# EAGLE design stspin820 (EAGLE 9.2.2)

## Sheet 1 of 2
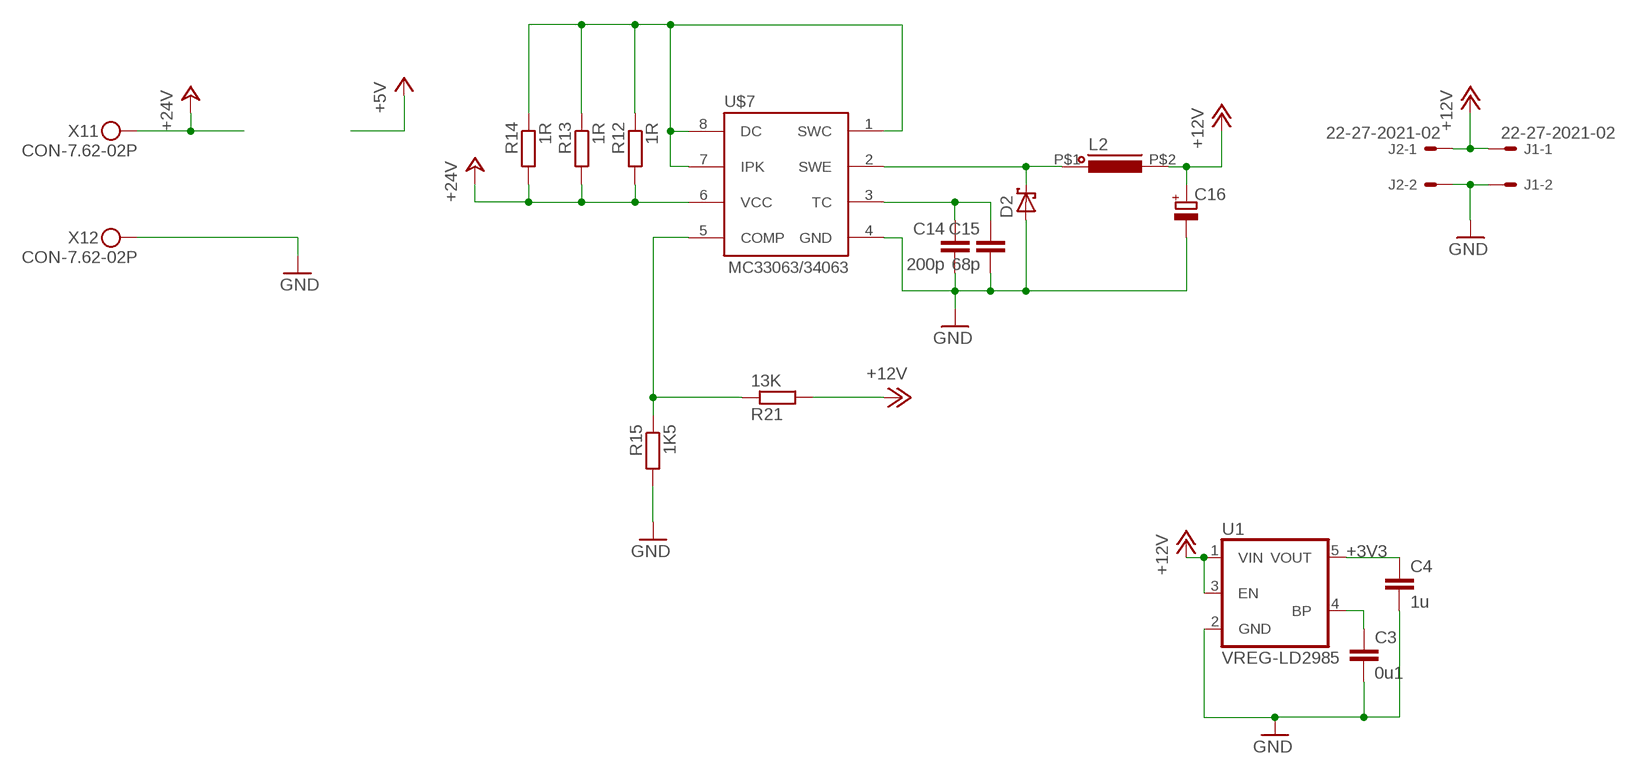
[diagram p0: schematic, sheet 1]

### Parts
C3  0u1  CAP_0805  [CAP0805]
C4  1u  CAP_0805  [CAP0805]
C14  200p  CAP_0805  [CAP0805]
C15  68p  CAP_0805  [CAP0805]
C16  CAP-POL_E3.5-8  [E3,5-8]
D2  DIODE-SH_SMA  [DO214AC]
J1  22-27-2021-02  [6410-02]
J2  22-27-2021-02  [6410-02]
L2  INDUCTORCW68  [CW68]
R12  1R  R_R0805  [RESC2012X50]
R13  1R  R_R0805  [RESC2012X50]
R14  1R  R_R0805  [RESC2012X50]
R15  1K5  R_R0805  [RESC2012X50]
R21  13K  R_R0805  [RESC2012X50]
U1  VREG-LD2985  [SOT95P280X145-5]
U$7  MC33063/MC34063P  [DIL08]
X1  CON-7.62-02P  [KF25C-7.62-02P-13]

### Nets
+3V3: C4.1 U1.5(VOUT) ; supply symbol labelled +5V ; also sheet 2
+12V: C16.+ J1.1 J2.1 L2.P$2 R21.2 U1.1(VIN) U1.3(EN)
+24V: R12.2 R13.2 R14.2 U$7.6(VCC) X1.P$1 ; also sheet 2
GND: C3.2 C4.2 C14.2 C15.2 C16.- D2.A J1.2 J2.2 R15.2 U1.2(GND) U$7.4(GND) X1.P$2 ; also sheet 2
N$22: C14.1 C15.1 U$7.3(TC)
N$23: R12.1 R13.1 R14.1 U$7.1(SWC) U$7.7(IPK) U$7.8(DC)
N$24: D2.C L2.P$1 U$7.2(SWE)
N$25: R15.1 R21.1 U$7.5(COMP)
N$26: C3.1 U1.4(BP)

## Sheet 2 of 2
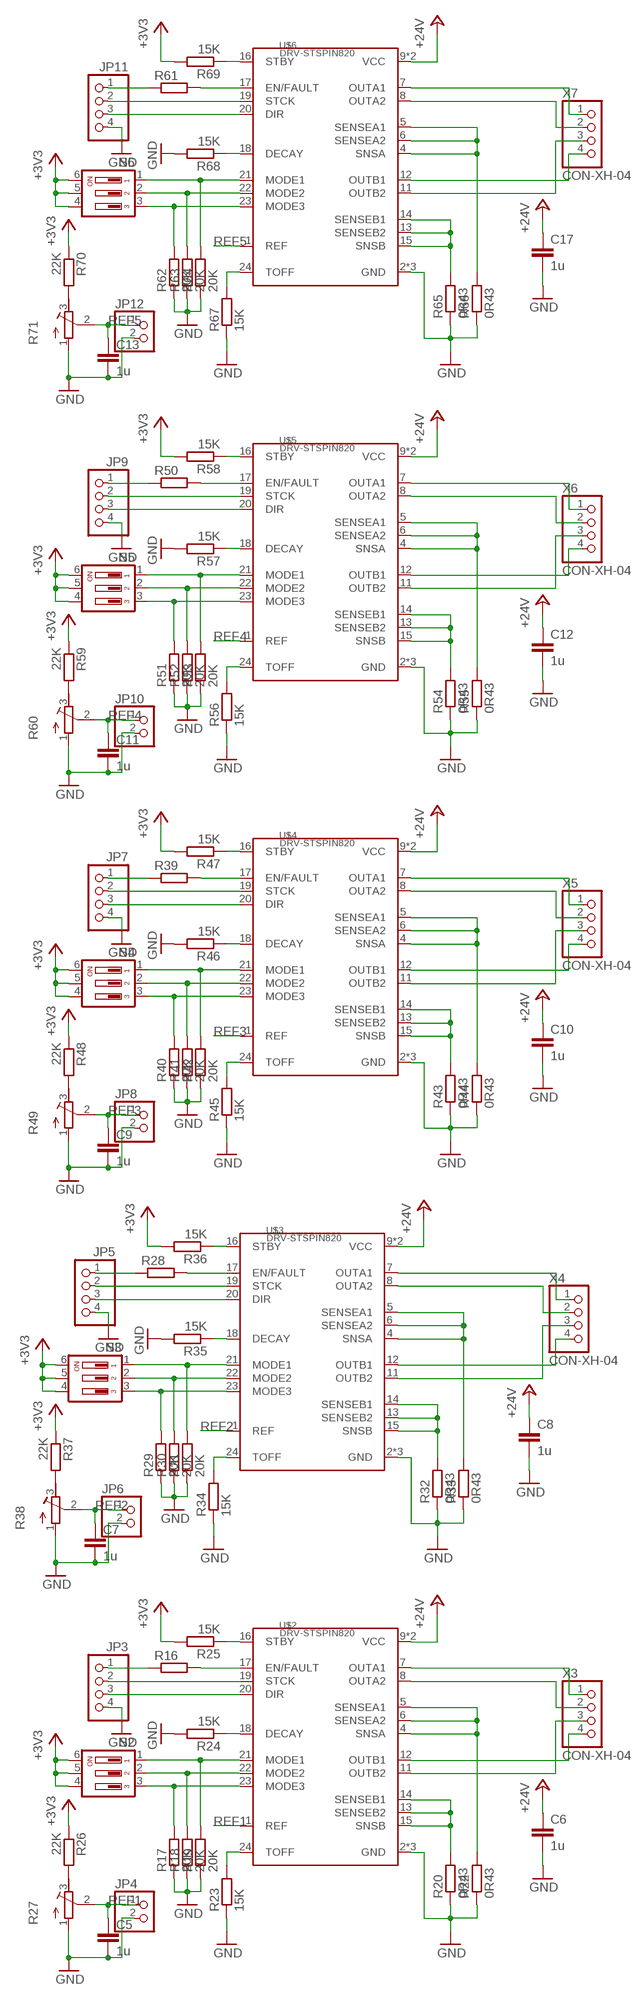
[diagram p1: schematic, sheet 2]

### Parts
C5  1u  CAP_0805  [CAP0805]
C6  1u  CAP_0805  [CAP0805]
C7  1u  CAP_0805  [CAP0805]
C8  1u  CAP_0805  [CAP0805]
C9  1u  CAP_0805  [CAP0805]
C10  1u  CAP_0805  [CAP0805]
C11  1u  CAP_0805  [CAP0805]
C12  1u  CAP_0805  [CAP0805]
C13  1u  CAP_0805  [CAP0805]
C17  1u  CAP_0805  [CAP0805]
JP3  PINHD-1X4  [1X04]
JP4  PINHD-1X2  [1X02]
JP5  PINHD-1X4  [1X04]
JP6  PINHD-1X2  [1X02]
JP7  PINHD-1X4  [1X04]
JP8  PINHD-1X2  [1X02]
JP9  PINHD-1X4  [1X04]
JP10  PINHD-1X2  [1X02]
JP11  PINHD-1X4  [1X04]
JP12  PINHD-1X2  [1X02]
R16  R_R0805  [RESC2012X50]
R17  20K  R_R0805  [RESC2012X50]
R18  20K  R_R0805  [RESC2012X50]
R19  20K  R_R0805  [RESC2012X50]
R20  0R43  R_R1206  [RESC3216X60]
R22  0R43  R_R1206  [RESC3216X60]
R23  15K  R_R0805  [RESC2012X50]
R24  15K  R_R0805  [RESC2012X50]
R25  15K  R_R0805  [RESC2012X50]
R26  22K  R_R0805  [RESC2012X50]
R27  R_POT3296X  [POT-3296X]
R28  R_R0805  [RESC2012X50]
R29  20K  R_R0805  [RESC2012X50]
R30  20K  R_R0805  [RESC2012X50]
R31  20K  R_R0805  [RESC2012X50]
R32  0R43  R_R1206  [RESC3216X60]
R33  0R43  R_R1206  [RESC3216X60]
R34  15K  R_R0805  [RESC2012X50]
R35  15K  R_R0805  [RESC2012X50]
R36  15K  R_R0805  [RESC2012X50]
R37  22K  R_R0805  [RESC2012X50]
R38  R_POT3296X  [POT-3296X]
R39  R_R0805  [RESC2012X50]
R40  20K  R_R0805  [RESC2012X50]
R41  20K  R_R0805  [RESC2012X50]
R42  20K  R_R0805  [RESC2012X50]
R43  0R43  R_R1206  [RESC3216X60]
R44  0R43  R_R1206  [RESC3216X60]
R45  15K  R_R0805  [RESC2012X50]
R46  15K  R_R0805  [RESC2012X50]
R47  15K  R_R0805  [RESC2012X50]
R48  22K  R_R0805  [RESC2012X50]
R49  R_POT3296X  [POT-3296X]
R50  R_R0805  [RESC2012X50]
R51  20K  R_R0805  [RESC2012X50]
R52  20K  R_R0805  [RESC2012X50]
R53  20K  R_R0805  [RESC2012X50]
R54  0R43  R_R1206  [RESC3216X60]
R55  0R43  R_R1206  [RESC3216X60]
R56  15K  R_R0805  [RESC2012X50]
R57  15K  R_R0805  [RESC2012X50]
R58  15K  R_R0805  [RESC2012X50]
R59  22K  R_R0805  [RESC2012X50]
R60  R_POT3296X  [POT-3296X]
R61  R_R0805  [RESC2012X50]
R62  20K  R_R0805  [RESC2012X50]
R63  20K  R_R0805  [RESC2012X50]
R64  20K  R_R0805  [RESC2012X50]
R65  0R43  R_R1206  [RESC3216X60]
R66  0R43  R_R1206  [RESC3216X60]
R67  15K  R_R0805  [RESC2012X50]
R68  15K  R_R0805  [RESC2012X50]
R69  15K  R_R0805  [RESC2012X50]
R70  22K  R_R0805  [RESC2012X50]
R71  R_POT3296X  [POT-3296X]
S2  SW-DIP03S  [DIP03YL]
S3  SW-DIP03S  [DIP03YL]
S4  SW-DIP03S  [DIP03YL]
S5  SW-DIP03S  [DIP03YL]
S6  SW-DIP03S  [DIP03YL]
U$2  DRV-STSPIN820  [QFN24]
U$3  DRV-STSPIN820  [QFN24]
U$4  DRV-STSPIN820  [QFN24]
U$5  DRV-STSPIN820  [QFN24]
U$6  DRV-STSPIN820  [QFN24]
X3  CON-XH-04  [XH-04]
X4  CON-XH-04  [XH-04]
X5  CON-XH-04  [XH-04]
X6  CON-XH-04  [XH-04]
X7  CON-XH-04  [XH-04]

### Nets
+3V3: R25.2 R26.1 R36.2 R37.1 R47.2 R48.1 R58.2 R59.1 R69.2 R70.1 S2.4 S2.5 S2.6 S3.4 S3.5 S3.6 S4.4 S4.5 S4.6 S5.4 S5.5 S5.6 S6.4 S6.5 S6.6 ; also sheet 1
+24V: C6.1 C8.1 C10.1 C12.1 C17.1 U$2.9(VCC) U$2.10(VCC) U$3.9(VCC) U$3.10(VCC) U$4.9(VCC) U$4.10(VCC) U$5.9(VCC) U$5.10(VCC) U$6.9(VCC) U$6.10(VCC) ; also sheet 1
GND: C5.2 C6.2 C7.2 C8.2 C9.2 C10.2 C11.2 C12.2 C13.2 C17.2 JP3.4 JP4.2 JP5.4 JP6.2 JP7.4 JP8.2 JP9.4 JP10.2 JP11.4 JP12.2 R17.1 R18.1 R19.1 R20.1 R22.1 R23.1 R24.2 R27.1(A) R29.1 R30.1 R31.1 R32.1 R33.1 R34.1 R35.2 R38.1(A) R40.1 R41.1 R42.1 R43.1 R44.1 R45.1 R46.2 R49.1(A) R51.1 R52.1 R53.1 R54.1 R55.1 R56.1 R57.2 R60.1(A) R62.1 R63.1 R64.1 R65.1 R66.1 R67.1 R68.2 R71.1(A) U$2.2(GND) U$2.3(GND) U$2.PAD(GND) U$3.2(GND) U$3.3(GND) U$3.PAD(GND) U$4.2(GND) U$4.3(GND) U$4.PAD(GND) U$5.2(GND) U$5.3(GND) U$5.PAD(GND) U$6.2(GND) U$6.3(GND) U$6.PAD(GND) ; also sheet 1
N$19: JP3.2 U$2.19(STCK)
N$20: JP3.3 U$2.20(DIR)
N$21: JP3.1 R16.1
N$27: R16.2 U$2.17(EN/FAULT)
N$28: R19.2 S2.1 U$2.21(MODE1)
N$29: R18.2 S2.2 U$2.22(MODE2)
N$30: R17.2 S2.3 U$2.23(MODE3)
N$31: R20.2 U$2.13(SENSEB2) U$2.14(SENSEB1) U$2.15(SNSB)
N$32: R22.2 U$2.4(SNSA) U$2.5(SENSEA1) U$2.6(SENSEA2)
N$33: U$2.7(OUTA1) X3.1
N$34: U$2.8(OUTA2) X3.2
N$35: R23.2 U$2.24(TOFF)
N$36: R25.1 U$2.16(STBY)
N$37: R24.1 U$2.18(DECAY)
N$39: U$2.11(OUTB2) X3.3
N$40: U$2.12(OUTB1) X3.4
N$41: R26.2 R27.3(E)
N$42: JP5.2 U$3.19(STCK)
N$43: JP5.3 U$3.20(DIR)
N$44: JP5.1 R28.1
N$45: R28.2 U$3.17(EN/FAULT)
N$46: R31.2 S3.1 U$3.21(MODE1)
N$47: R30.2 S3.2 U$3.22(MODE2)
N$48: R29.2 S3.3 U$3.23(MODE3)
N$50: R32.2 U$3.13(SENSEB2) U$3.14(SENSEB1) U$3.15(SNSB)
N$51: R33.2 U$3.4(SNSA) U$3.5(SENSEA1) U$3.6(SENSEA2)
N$52: U$3.7(OUTA1) X4.1
N$53: U$3.8(OUTA2) X4.2
N$54: R34.2 U$3.24(TOFF)
N$55: R36.1 U$3.16(STBY)
N$56: R35.1 U$3.18(DECAY)
N$58: U$3.11(OUTB2) X4.3
N$59: U$3.12(OUTB1) X4.4
N$60: R37.2 R38.3(E)
N$61: JP7.2 U$4.19(STCK)
N$62: JP7.3 U$4.20(DIR)
N$63: JP7.1 R39.1
N$64: R39.2 U$4.17(EN/FAULT)
N$65: R42.2 S4.1 U$4.21(MODE1)
N$67: R41.2 S4.2 U$4.22(MODE2)
N$68: R40.2 S4.3 U$4.23(MODE3)
N$69: R43.2 U$4.13(SENSEB2) U$4.14(SENSEB1) U$4.15(SNSB)
N$70: R44.2 U$4.4(SNSA) U$4.5(SENSEA1) U$4.6(SENSEA2)
N$71: U$4.7(OUTA1) X5.1
N$72: U$4.8(OUTA2) X5.2
N$73: R45.2 U$4.24(TOFF)
N$74: R47.1 U$4.16(STBY)
N$75: R46.1 U$4.18(DECAY)
N$77: U$4.11(OUTB2) X5.3
N$78: U$4.12(OUTB1) X5.4
N$79: R48.2 R49.3(E)
N$80: JP9.2 U$5.19(STCK)
N$81: JP9.3 U$5.20(DIR)
N$82: JP9.1 R50.1
N$84: R50.2 U$5.17(EN/FAULT)
N$85: R53.2 S5.1 U$5.21(MODE1)
N$86: R52.2 S5.2 U$5.22(MODE2)
N$87: R51.2 S5.3 U$5.23(MODE3)
N$88: R54.2 U$5.13(SENSEB2) U$5.14(SENSEB1) U$5.15(SNSB)
N$89: R55.2 U$5.4(SNSA) U$5.5(SENSEA1) U$5.6(SENSEA2)
N$90: U$5.7(OUTA1) X6.1
N$91: U$5.8(OUTA2) X6.2
N$92: R56.2 U$5.24(TOFF)
N$93: R58.1 U$5.16(STBY)
N$94: R57.1 U$5.18(DECAY)
N$96: U$5.11(OUTB2) X6.3
N$97: U$5.12(OUTB1) X6.4
N$98: R59.2 R60.3(E)
N$99: JP11.2 U$6.19(STCK)
N$101: JP11.3 U$6.20(DIR)
N$102: JP11.1 R61.1
N$103: R61.2 U$6.17(EN/FAULT)
N$104: R64.2 S6.1 U$6.21(MODE1)
N$105: R63.2 S6.2 U$6.22(MODE2)
N$106: R62.2 S6.3 U$6.23(MODE3)
N$107: R65.2 U$6.13(SENSEB2) U$6.14(SENSEB1) U$6.15(SNSB)
N$108: R66.2 U$6.4(SNSA) U$6.5(SENSEA1) U$6.6(SENSEA2)
N$109: U$6.7(OUTA1) X7.1
N$110: U$6.8(OUTA2) X7.2
N$111: R67.2 U$6.24(TOFF)
N$112: R69.1 U$6.16(STBY)
N$113: R68.1 U$6.18(DECAY)
N$115: U$6.11(OUTB2) X7.3
N$116: U$6.12(OUTB1) X7.4
N$117: R70.2 R71.3(E)
REF1: C5.1 JP4.1 R27.2(S) U$2.1(REF)
REF2: C7.1 JP6.1 R38.2(S) U$3.1(REF)
REF3: C9.1 JP8.1 R49.2(S) U$4.1(REF)
REF4: C11.1 JP10.1 R60.2(S) U$5.1(REF)
REF5: C13.1 JP12.1 R71.2(S) U$6.1(REF)

## Library data of the parts
C3-C15 C17 = Flamberm:CAP_
C16 = Namenlos:CAP-POL_
D2 = Namenlos:DIODE-SH_
J1 J2 = con-molex:22-?-02: CONNECTOR wire to board 2.54 mm (.1 inch) pitch header; MF: MOLEX; OC_FARNELL: unknown; OC_NEWARK: unknown
JP3 JP5 JP7 JP9 JP11 = pinhead:PINHD-1X4: PIN HEADER
JP4 JP6 JP8 JP10 JP12 = pinhead:PINHD-1X2: PIN HEADER
L2 = Namenlos:INDUCTOR
R12-R26 R28-R37 R39-R48 R50-R59 R61-R70 = Flamberm:R_
R27 R38 R49 R60 R71 = Flamberm:R_POT
S2-S6 = Flamberm:SW-DIP03S: DIL/CODE SWITCH; OC_FARNELL: unknown; OC_NEWARK: unknown
U1 = Flamberm:VREG-LD2985
U$2-U$6 = Flamberm:DRV-STSPIN820
U$7 = adafruit:MC33063/MC34063: MC33063 and MC34063 Basic DC/DC converter with internal power-NPN transistor, 100KHz, 1.5A peak switch current. 3-40 input/output.
X1 = Flamberm:CON-7.62-02P
X3-X7 = Flamberm:CON-XH-04

## Board
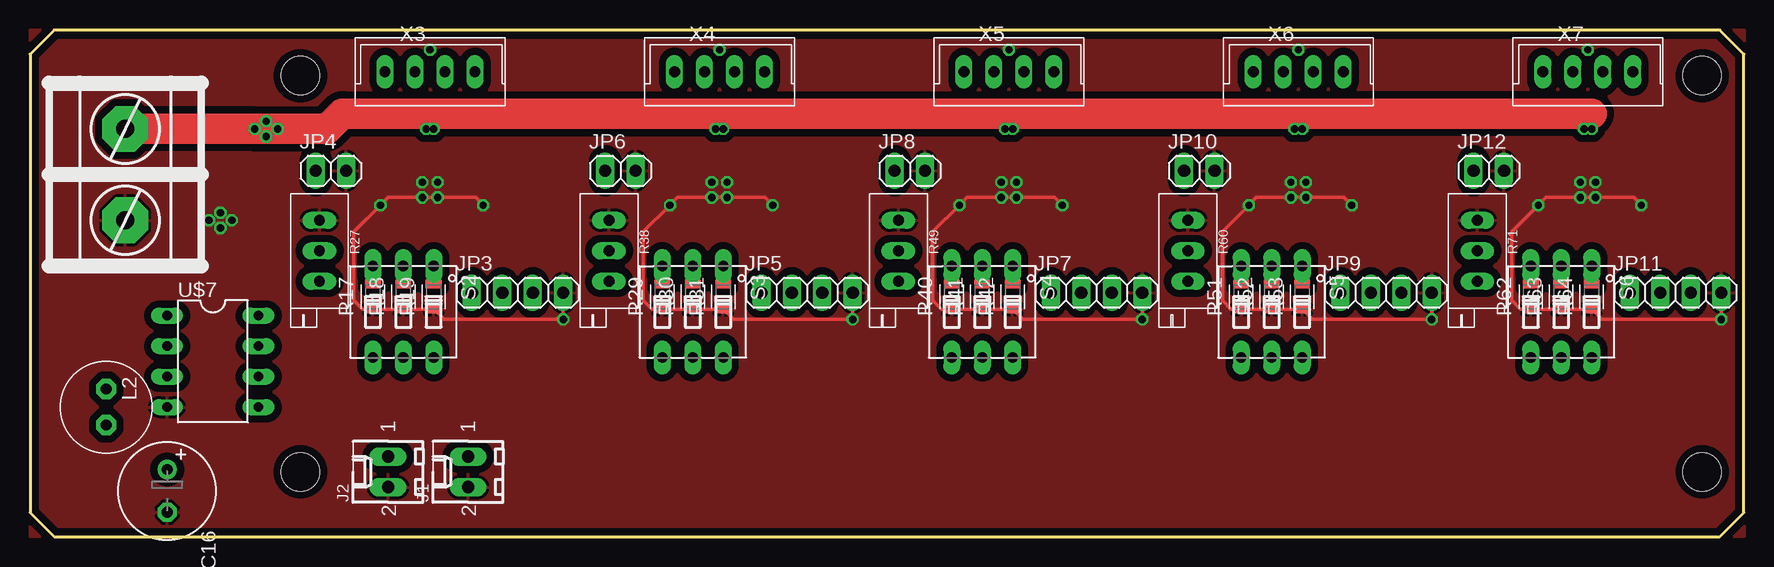
[diagram p2: board, top side]
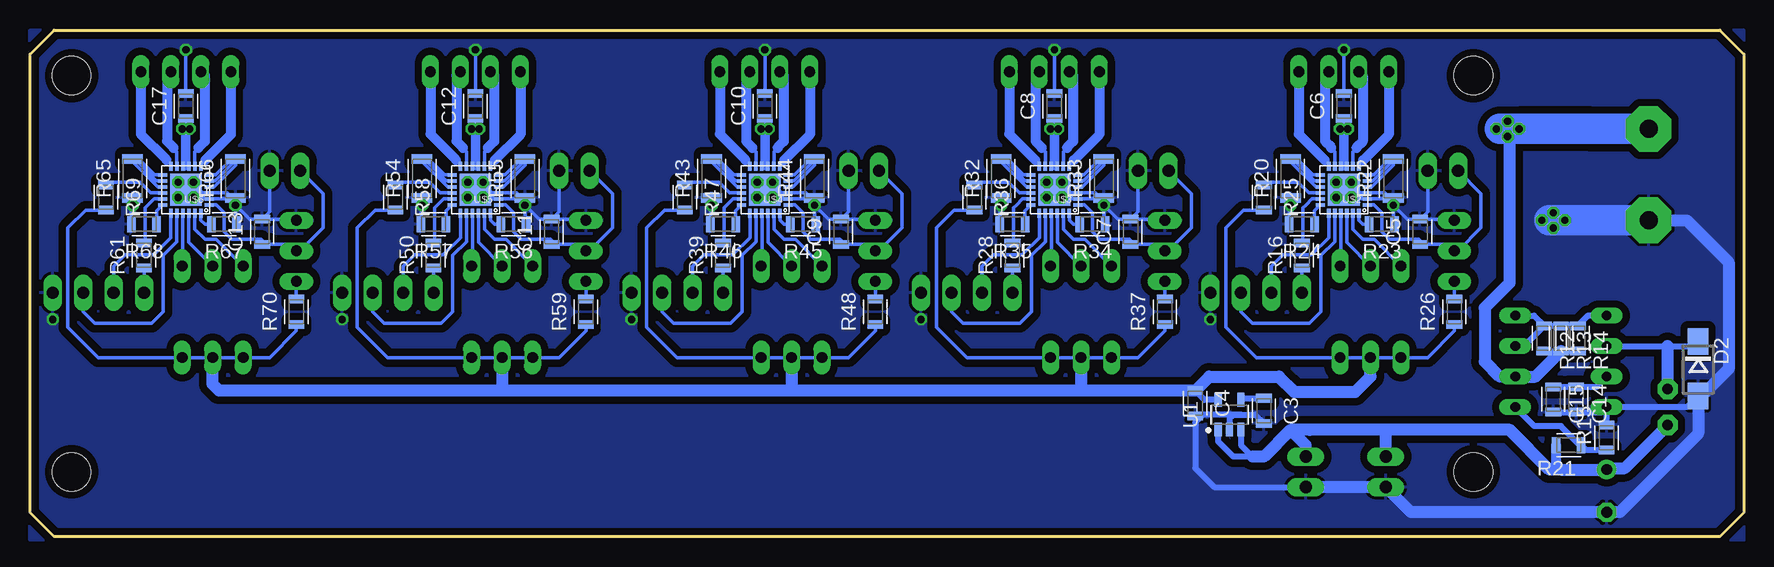
[diagram p3: board, bottom side, seen from below]

Size 142.86 x 42.21 mm. Coordinates in mm from the lower left corner, seen from the top.
Outline: 140.86,42.21 2,42.21 0,40.21 0,2 2,0 140.86,0 142.86,2 142.86,40.21 140.86,42.21
Copper layers (1*16): Top 0.035mm / dielectric 1.5mm / Bottom 0.035mm
Design rules "EagleDesignRules": minimum track width 0.25mm, minimum drill 0.3mm, track to track 0.25mm, track to pad 0.25mm, pad to pad 0.25mm, via to via 0.25mm, smd to smd 0.25mm, copper to edge 0.5mm, drill to drill 0.5mm, minimum pad ring 10mil, minimum via ring 8mil, stop-mask expansion 4mil, vias tented up to drill 0mil, thermal gap 0.25mm
Holes 3.2 mm at 22.54,38.42 22.54,5.4 139.38,5.4 139.38,38.42

### Footprints (pad centres in the part's own frame; a part is rotated, then mirrored left to right if it is on the bottom)
CAP0805 = smd 0.712 x 1.312: 1 -1.05,0; 2 1.05,0
E3,5-8 = drill 0.9 pad 1.6: + -1.778,0 | drill 0.9 pad 1.6 octagon: - 1.778,0
DO214AC = smd 2.2 x 1.7: A 2.25,0; C -2.285,0
6410-02 = drill 1.016 long: 1 1.27,0; 2 -1.27,0
1X04 = drill 1.016 long: 1 -3.81,0; 2 -1.27,0; 3 1.27,0; 4 3.81,0
1X02 = drill 1.016 long: 1 -1.27,0; 2 1.27,0
CW68 = drill 0.9 pad 1.676 octagon: P$1 -1.5,0; P$2 1.5,0
RESC2012X50 = smd 0.712 x 1.312: 1 -1.05,0; 2 1.05,0
RESC3216X60 = smd 0.762 x 1.712: 1 -1.625,0; 2 1.625,0
POT-3296X = drill 0.9 long: 1 0,-2.54; 2 0,0; 3 0,2.54
DIP03YL = drill 0.9 long: 1 -2.54,-3.81; 2 0,-3.81; 3 2.54,-3.81; 4 2.54,3.81; 5 0,3.81; 6 -2.54,3.81
SOT95P280X145-5 = smd 1.127 x 0.589: 1 -1.242,0.95; 2 -1.242,0; 3 -1.242,-0.95; 4 1.242,-0.95; 5 1.242,0.95
QFN24 = smd 0.75 x 0.3: 1 -1.95,1.25; 2 -1.95,0.75; 3 -1.95,0.25; 4 -1.95,-0.25; 5 -1.95,-0.75; 6 -1.95,-1.25; 13 1.95,-1.25; 14 1.95,-0.75; 15 1.95,-0.25; 16 1.95,0.25; 17 1.95,0.75; 18 1.95,1.25 | smd 0.3 x 0.75: 7 -1.25,-1.95; 8 -0.75,-1.95; 9 -0.25,-1.95; 10 0.25,-1.95; 11 0.75,-1.95; 12 1.25,-1.95; 19 1.25,1.95; 20 0.75,1.95; 21 0.25,1.95; 22 -0.25,1.95; 23 -0.75,1.95; 24 -1.25,1.95 | smd 2.65 x 2.65: PAD 0,0
DIL08 = drill 0.813 long: 1 -3.81,-3.81; 2 -1.27,-3.81; 3 1.27,-3.81; 4 3.81,-3.81; 5 3.81,3.81; 6 1.27,3.81; 7 -1.27,3.81; 8 -3.81,3.81
KF25C-7.62-02P-13 = drill 1.5 pad 3.81 octagon: P$1 -3.81,0; P$2 3.81,0
XH-04 = drill 0.9 long: 1 -3.75,0; 2 -1.25,0; 3 1.25,0; 4 3.75,0

### Placement (x,y rotation side)
C3  40.01,10.48 270 bottom
C4  45.72,11.11 270 bottom
C5  26.99,25.4 90 bottom
C6  33.34,35.88 90 bottom
C7  51.12,25.4 90 bottom
C8  57.47,35.88 90 bottom
C9  75.25,25.4 90 bottom
C10  81.6,35.88 90 bottom
C11  99.38,25.4 90 bottom
C12  105.73,35.88 90 bottom
C13  123.51,25.4 90 bottom
C14  13.97,11.43 270 bottom
C15  15.88,11.43 270 bottom
C16  11.43,3.81 270 top
C17  129.86,35.88 90 bottom
D2  3.81,13.97 270 bottom
J1  36.51,5.4 90 top
J2  29.85,5.4 90 top
JP3  40.64,20.32 0 top
JP4  25.08,30.48 0 top
JP5  64.77,20.32 0 top
JP6  49.21,30.48 0 top
JP7  88.9,20.32 0 top
JP8  73.34,30.48 0 top
JP9  113.03,20.32 0 top
JP10  97.47,30.48 0 top
JP11  137.16,20.32 0 top
JP12  121.6,30.48 0 top
L2  6.35,10.79 270 top
R12  16.64,16.51 270 bottom
R13  15.24,16.51 270 bottom
R14  13.84,16.51 270 bottom
R15  11.43,8.25 90 bottom
R16  36.83,23.43 90 bottom
R17  28.58,20 90 top
R18  31.12,20 90 top
R19  33.66,20 90 top
R20  37.78,29.85 90 bottom
R21  14.61,7.62 180 bottom
R22  29.21,29.85 90 bottom
R23  30.16,26.04 180 bottom
R24  36.83,26.04 180 bottom
R25  40.01,28.26 270 bottom
R26  24.13,18.73 90 bottom
R27  24.13,23.81 180 top
R28  60.96,23.43 90 bottom
R29  52.7,20 90 top
R30  55.25,20 90 top
R31  57.79,20 90 top
R32  61.91,29.85 90 bottom
R33  53.34,29.85 90 bottom
R34  54.29,26.04 180 bottom
R35  60.96,26.04 180 bottom
R36  64.14,28.26 270 bottom
R37  48.26,18.73 90 bottom
R38  48.26,23.81 180 top
R39  85.09,23.43 90 bottom
R40  76.84,20 90 top
R41  79.38,20 90 top
R42  81.91,20 90 top
R43  86.04,29.85 90 bottom
R44  77.47,29.85 90 bottom
R45  78.42,26.04 180 bottom
R46  85.09,26.04 180 bottom
R47  88.27,28.26 270 bottom
R48  72.39,18.73 90 bottom
R49  72.39,23.81 180 top
R50  109.22,23.43 90 bottom
R51  100.97,20 90 top
R52  103.5,20 90 top
R53  106.05,20 90 top
R54  110.17,29.85 90 bottom
R55  101.6,29.85 90 bottom
R56  102.55,26.04 180 bottom
R57  109.22,26.04 180 bottom
R58  112.39,28.26 270 bottom
R59  96.52,18.73 90 bottom
R60  96.52,23.81 180 top
R61  133.35,23.43 90 bottom
R62  125.09,20 90 top
R63  127.64,20 90 top
R64  130.18,20 90 top
R65  134.3,29.85 90 bottom
R66  125.73,29.85 90 bottom
R67  126.68,26.04 180 bottom
R68  133.35,26.04 180 bottom
R69  136.53,28.26 270 bottom
R70  120.65,18.73 90 bottom
R71  120.65,23.81 180 top
S2  31.12,18.73 180 top
S3  55.25,18.73 180 top
S4  79.38,18.73 180 top
S5  103.5,18.73 180 top
S6  127.64,18.73 180 top
U1  42.86,10.16 90 bottom
U$2  33.34,28.89 180 bottom
U$3  57.47,28.89 180 bottom
U$4  81.6,28.89 180 bottom
U$5  105.73,28.89 180 bottom
U$6  129.86,28.89 180 bottom
U$7  15.24,14.6 270 top
X1  7.94,30.16 270 top
X3  33.34,38.73 0 top
X4  57.47,38.73 0 top
X5  81.6,38.73 0 top
X6  105.73,38.73 0 top
X7  129.86,38.73 0 top

### Tracks (layer width: path | path; a pad name or v marks a point on that pad's centre or on a via)
+3V3
  Bottom 0.305: R25.2 41.69,27.21 43.18,25.72 43.18,17.46 40.64,14.92 S2.6 S2.5 S2.4 26.35,14.92 24.13,17.14 R26.1 | R36.2 65.82,27.21 67.31,25.72 67.31,17.46 64.77,14.92 S3.6 S3.5 S3.4 50.48,14.92 48.26,17.14 R37.1 | R47.2 89.95,27.21 91.44,25.72 91.44,17.46 88.9,14.92 S4.6 S4.5 S4.4 74.61,14.92 72.39,17.14 R48.1 | R58.2 114.08,27.21 115.57,25.72 115.57,17.46 113.03,14.92 S5.6 S5.5 S5.4 98.74,14.92 96.52,17.14 R59.1 | R69.2 138.21,27.21 139.7,25.72 139.7,17.46 137.16,14.92 S6.6 S6.5 S6.4 122.87,14.92 120.65,17.14 R70.1
  Bottom 0.508: U1.5 44.96,11.4 C4.1
  Bottom 1.016: 55.25,12.16 C4.1 44.55,13.33 38.74,13.33 37.47,12.07 32.38,12.07 31.12,13.33 S2.5 | 55.25,12.16 79.37,12.16 | 79.37,12.16 103.5,12.16 | 103.5,12.16 127.1,12.16 127.64,12.7 S6.5 | S5.5 103.5,12.16 | S4.5 79.37,12.16 | S3.5 55.25,12.16
+12V
  Bottom 0.508: U1.3 41.91,7.62 40.96,6.67 42.54,6.67 43.81,7.94 U1.1
  Bottom 0.813: R21.2 15.65,6 15.24,5.59
  Bottom 1.016: L2.P$2 9.93,5.71 11.3,5.71 C16.+ 15.24,5.59 16.19,5.59 19.49,8.89 29.85,8.89 | 37.78,8.89 40.01,6.67 40.96,6.67 | 29.85,8.89 36.19,8.89 37.78,8.89 | J1.1 36.51,7.62 37.78,8.89 | J2.1 29.85,8.89
+24V  (via drill 0.6)
  Top 0.61: v33.02,33.97 33.02,35.24 33.65,34.61 v33.65,33.97 | v57.15,33.97 57.15,34.92 56.83,35.24 57.79,34.29 v57.79,33.97 | v81.91,33.97 81.91,34.92 81.6,35.24 | v105.41,33.97 105.41,35.24 106.04,34.61 v106.04,33.97 | v129.54,33.97 129.54,34.61 130.17,35.24 v130.17,33.97
  Top 2.54: X1.P$1 v18.73,33.97 v20.64,33.97 24.76,33.97 26.04,35.24 33.02,35.24 56.83,35.24 81.6,35.24 105.41,35.24 130.17,35.24
  Bottom 0.305: v20.64,33.97 20.32,33.97 v19.69,33.34 | C6.1 33.34,34.29 | C6.1 33.34,34.29 | C6.1 33.34,34.29 | 33.34,30.67 33.34,31.12 | 33.34,31.12 33.34,34.16 33.53,33.97 v33.65,33.97 | v33.65,33.97 33.59,33.9 U$2.10 33.59,30.87 33.34,31.12 | 33.34,31.12 33.09,30.87 U$2.9 33.09,33.9 v33.02,33.97 33.34,34.29 | v33.65,33.97 33.34,34.29 | C8.1 57.47,34.29 | C8.1 57.47,34.29 | C8.1 57.47,34.29 | 57.47,30.67 57.47,31.12 | 57.47,31.12 57.47,34.16 57.66,33.97 v57.79,33.97 | v57.79,33.97 57.72,33.9 U$3.10 57.72,30.87 57.47,31.12 | 57.47,31.12 57.22,30.87 U$3.9 57.22,33.9 v57.15,33.97 57.47,34.29 | v57.79,33.97 57.47,34.29 | C10.1 81.6,34.29 | C10.1 81.6,34.29 | C10.1 81.6,34.29 | 81.6,30.67 81.6,31.12 | 81.6,31.12 81.6,34.16 81.79,33.97 v81.91,33.97 | v81.91,33.97 81.85,33.9 U$4.10 81.85,30.87 81.6,31.12 | 81.6,31.12 81.35,30.87 U$4.9 81.35,33.9 v81.28,33.97 81.6,34.29 | v81.91,33.97 81.6,34.29 | C12.1 105.73,34.29 | C12.1 105.73,34.29 | C12.1 105.73,34.29 | 105.73,30.67 105.73,31.12 | 105.73,31.12 105.73,34.16 105.92,33.97 v106.04,33.97 | v106.04,33.97 105.98,33.9 U$5.10 105.98,30.87 105.73,31.12 | 105.73,31.12 105.48,30.87 U$5.9 105.48,33.9 v105.41,33.97 105.73,34.29 | v106.04,33.97 105.73,34.29 | C17.1 129.86,34.29 | C17.1 129.86,34.29 | C17.1 129.86,34.29 | 129.86,30.67 129.86,31.12 | 129.86,31.12 129.86,34.16 130.05,33.97 v130.17,33.97 | v130.17,33.97 130.11,33.9 U$6.10 130.11,30.87 129.86,31.12 | 129.86,31.12 129.61,30.87 U$6.9 129.61,33.9 v129.54,33.97 129.86,34.29 | v130.17,33.97 129.86,34.29
  Bottom 0.508: R12.2 R13.2 R14.2
  Bottom 1.016: v19.69,33.34 19.53,33.18 19.53,21.11 21.59,19.05 21.59,14.6 20.32,13.33 U$7.6 17.37,13.33 R13.2 | v19.69,34.61 20.32,33.97
  Bottom 2.54: X1.P$1 12.7,33.97 v18.73,33.97 20.32,33.97
GND  (via drill 0.6)
  Top 0.305: JP3.4 v44.45,18.1 34.51,18.1 R19.1 R18.1 R17.1 27.72,18.95 26.99,19.69 26.99,25.4 v29.21,27.62 29.85,28.26 v32.7,28.26 v33.97,28.26 37.15,28.26 v37.78,27.62 | JP5.4 v68.58,18.1 58.64,18.1 R31.1 R30.1 R29.1 51.85,18.95 51.12,19.69 51.12,25.4 v53.34,27.62 53.97,28.26 v56.83,28.26 v58.1,28.26 61.28,28.26 v61.91,27.62 | JP7.4 v92.71,18.1 82.77,18.1 R42.1 R41.1 R40.1 75.98,18.95 75.25,19.69 75.25,25.4 v77.47,27.62 78.11,28.26 v80.96,28.26 v82.23,28.26 85.41,28.26 v86.04,27.62 | JP9.4 v116.84,18.1 106.9,18.1 R53.1 R52.1 R51.1 100.11,18.95 99.38,19.69 99.38,25.4 v101.6,27.62 102.23,28.26 v105.09,28.26 v106.36,28.26 109.54,28.26 v110.17,27.62 | JP11.4 v140.97,18.1 131.03,18.1 R64.1 R63.1 R62.1 124.24,18.95 123.51,19.69 123.51,25.4 v125.73,27.62 126.36,28.26 v129.22,28.26 v130.49,28.26 133.67,28.26 v134.3,27.62
  Bottom 0.305: C6.2 v33.34,40.57 | R22.1 29.21,27.94 | 29.21,27.94 v29.21,27.62 | R20.1 v37.78,27.62 37.88,27.53 R24.2 | R23.1 29.21,26.13 v29.21,27.62 | v29.21,27.62 29.73,28.14 U$2.2 31.89,28.14 31.89,28.26 31.89,28.59 31.94,28.64 | 29.21,27.94 29.91,28.64 U$2.3 31.94,28.64 | U$2.PAD 33.21,28.89 33.04,29.07 32.37,29.07 31.94,28.64 | v29.21,27.62 28.04,26.45 C5.2 | C5.2 24.23,26.45 R27.1 | JP4.2 26.35,27.08 C5.2 | U$2.PAD v33.97,29.53 | U$2.PAD v32.7,29.53 | C8.2 v57.47,40.57 | R33.1 53.34,27.94 | 53.34,27.94 v53.34,27.62 | R32.1 v61.91,27.62 62.01,27.53 R35.2 | R34.1 53.34,26.13 v53.34,27.62 | v53.34,27.62 53.86,28.14 U$3.2 56.02,28.14 56.02,28.26 56.02,28.59 56.07,28.64 | 53.34,27.94 54.04,28.64 U$3.3 56.07,28.64 | U$3.PAD 57.34,28.89 57.17,29.07 56.5,29.07 56.07,28.64 | v53.34,27.62 52.17,26.45 C7.2 | C7.2 48.36,26.45 R38.1 | JP6.2 50.48,27.08 C7.2 | U$3.PAD v58.1,29.53 | U$3.PAD v56.83,29.53 | C10.2 v81.6,40.57 | R44.1 77.47,27.94 | 77.47,27.94 v77.47,27.62 | R43.1 v86.04,27.62 86.14,27.53 R46.2 | R45.1 77.47,26.13 v77.47,27.62 | v77.47,27.62 77.99,28.14 U$4.2 80.15,28.14 80.15,28.26 80.15,28.59 80.2,28.64 | 77.47,27.94 78.17,28.64 U$4.3 80.2,28.64 | U$4.PAD 81.47,28.89 81.3,29.07 80.63,29.07 80.2,28.64 | v77.47,27.62 76.3,26.45 C9.2 | C9.2 72.49,26.45 R49.1 | JP8.2 74.61,27.08 C9.2 | U$4.PAD v82.23,29.53 | U$4.PAD v80.96,29.53 | C12.2 v105.73,40.57 | R55.1 101.6,27.94 | 101.6,27.94 v101.6,27.62 | R54.1 v110.17,27.62 110.27,27.53 R57.2 | R56.1 101.6,26.13 v101.6,27.62 | v101.6,27.62 102.12,28.14 U$5.2 104.28,28.14 104.28,28.26 104.28,28.59 104.33,28.64 | 101.6,27.94 102.3,28.64 U$5.3 104.33,28.64 | U$5.PAD 105.6,28.89 105.43,29.07 104.76,29.07 104.33,28.64
  Bottom 0.305: v101.6,27.62 100.43,26.45 C11.2 | C11.2 96.62,26.45 R60.1 | JP10.2 98.74,27.08 C11.2 | U$5.PAD v106.36,29.53 | U$5.PAD v105.09,29.53 | C17.2 v129.86,40.57 | R66.1 125.73,27.94 | 125.73,27.94 v125.73,27.62 | R65.1 v134.3,27.62 134.4,27.53 R68.2 | R67.1 125.73,26.13 v125.73,27.62 | v125.73,27.62 126.25,28.14 U$6.2 128.41,28.14 128.41,28.26 128.41,28.59 128.46,28.64 | 125.73,27.94 126.43,28.64 U$6.3 128.46,28.64 | U$6.PAD 129.73,28.89 129.56,29.07 128.89,29.07 128.46,28.64 | v125.73,27.62 124.56,26.45 C13.2 | C13.2 120.75,26.45 R71.1 | JP12.2 122.87,27.08 C13.2 | U$6.PAD v130.49,29.53 | U$6.PAD v129.22,29.53
  Bottom 0.508: D2.A 4.73,10.8 U$7.4 | R15.2 U$7.4 | U$7.4 11.84,10.38 C14.2 C15.2 | C3.2 40.74,10.16 41.91,10.16 | U1.2 42.86,9.84 42.54,10.16 41.91,10.16 | 41.91,10.16 45.08,10.16 | 45.08,10.16 45.72,9.52 45.72,5.71 44.13,4.13 J1.2 | 45.08,10.16 45.18,10.06 C4.2
  Bottom 1.016: X1.P$2 4.76,26.35 1.27,22.86 1.27,13.97 3.52,11.72 D2.A 3.81,8.57 10.35,2.03 C16.- 27.75,2.03 J2.2 J1.2
  Bottom 2.54: X1.P$2 16.19,26.35
  other vias: 14.92,26.35 15.88,26.99 15.88,25.72 16.83,26.35
  pour Top (isolate 0.61): 0,42.23 142.88,42.23 142.88,0 0,0
  pour Bottom (isolate 0.61): 0,-0.32 142.88,-0.32 142.88,42.23 0,42.23
N$19
  Bottom 0.305: U$2.19 34.59,24.91 36.03,23.47 37.65,23.47 37.68,23.49 38.42,23.49 39.37,22.54 JP3.2
N$20
  Bottom 0.305: U$2.20 34.09,24.59 35.24,23.43 35.24,18.73 36.19,17.78 40.96,17.78 41.91,18.73 JP3.3
N$21
  Bottom 0.305: R16.1 JP3.1
N$22
  Bottom 0.508: C15.1 C14.1 12.29,12.48 U$7.3
N$23
  Bottom 0.508: R12.1 R13.1 R14.1 12.99,18.42 U$7.1 | U$7.8 17.49,18.42 R12.1 | U$7.7 18.32,15.87 R12.1
N$24
  Bottom 0.508: U$7.2 6.35,15.87 4.19,15.87 D2.C
  Bottom 1.016: L2.P$1 6.35,15.87
N$25
  Bottom 0.508: R15.1 13.14,7.2 R21.1 13.65,7.62 15.24,9.21 17.46,9.21 U$7.5
N$26
  Bottom 0.508: U1.4 41.79,11.53 C3.1
N$27
  Bottom 0.305: U$2.17 35.99,28.14 36.51,27.62 36.73,27.4 36.73,24.58 R16.2
N$28
  Top 0.305: R19.2 S2.1
  Bottom 0.305: U$2.21 33.59,22.61 S2.1
N$29
  Top 0.305: R18.2 S2.2
  Bottom 0.305: U$2.22 33.09,24.51 S2.2
N$30
  Top 0.305: R17.2 S2.3
  Bottom 0.305: U$2.23 32.59,25.6 31.75,24.76 30.8,24.76 S2.3
N$31
  Bottom 0.305: U$2.13 35.92,30.14 37.52,31.74 R20.2 | U$2.14 35.8,29.64 37.7,31.55 R20.2 | R20.2 37.78,31.26 35.67,29.14 U$2.15
N$32
  Bottom 0.305: R22.2 29.37,31.63 30.86,30.14 U$2.6 | U$2.4 30.99,29.14 29.21,30.92 R22.2 | U$2.5 30.91,29.64 29.21,31.34 R22.2
N$33
  Bottom 0.305: U$2.7 32.09,31.01 31.72,31.37
  Bottom 0.813: X3.1 29.59,33.51 31.72,31.37
N$34
  Bottom 0.305: U$2.8 32.59,32.08 32.28,32.39
  Bottom 0.813: X3.2 31.77,38.42 31.77,32.94 32.28,32.43 32.28,32.39
N$35
  Bottom 0.305: U$2.24 32.09,26.37 31.75,26.03 R23.2
N$36
  Bottom 0.305: U$2.16 36.26,28.64 37.15,29.53 39.78,29.53 R25.1
N$37
  Bottom 0.305: U$2.18 35.78,27.15 R24.1
N$39
  Bottom 0.305: 34.4,32.39 34.09,32.08 U$2.11
  Bottom 0.813: X3.3 34.9,38.42 34.9,32.95 34.4,32.44 34.4,32.39
N$40
  Bottom 0.305: U$2.12 34.59,31.03 34.95,31.39
  Bottom 0.813: X3.4 37.09,33.53 34.95,31.39
N$41
  Bottom 0.305: R26.2 R27.3
N$42
  Bottom 0.305: U$3.19 58.72,24.91 60.16,23.47 61.78,23.47 61.81,23.49 62.55,23.49 63.5,22.54 JP5.2
N$43
  Bottom 0.305: U$3.20 58.22,24.59 59.37,23.43 59.37,18.73 60.33,17.78 65.09,17.78 66.04,18.73 JP5.3
N$44
  Bottom 0.305: R28.1 JP5.1
N$45
  Bottom 0.305: U$3.17 60.12,28.14 60.64,27.62 60.86,27.4 60.86,24.58 R28.2
N$46
  Top 0.305: R31.2 S3.1
  Bottom 0.305: U$3.21 57.72,22.61 S3.1
N$47
  Top 0.305: R30.2 S3.2
  Bottom 0.305: U$3.22 57.22,24.51 S3.2
N$48
  Top 0.305: R29.2 S3.3
  Bottom 0.305: U$3.23 56.72,25.6 55.88,24.76 54.93,24.76 S3.3
N$50
  Bottom 0.305: U$3.13 60.05,30.14 61.65,31.74 R32.2 | U$3.14 59.93,29.64 61.83,31.55 R32.2 | R32.2 61.91,31.26 59.8,29.14 U$3.15
N$51
  Bottom 0.305: R33.2 53.5,31.63 54.98,30.14 U$3.6 | U$3.4 55.12,29.14 53.34,30.92 R33.2 | U$3.5 55.04,29.64 53.34,31.34 R33.2
N$52
  Bottom 0.305: U$3.7 56.22,31.01 55.85,31.37
  Bottom 0.813: X4.1 53.72,33.51 55.85,31.37
N$53
  Bottom 0.305: U$3.8 56.72,32.08 56.41,32.39
  Bottom 0.813: X4.2 55.9,38.42 55.9,32.94 56.41,32.43 56.41,32.39
N$54
  Bottom 0.305: U$3.24 56.22,26.37 55.88,26.03 R34.2
N$55
  Bottom 0.305: U$3.16 60.39,28.64 61.28,29.53 63.91,29.53 R36.1
N$56
  Bottom 0.305: U$3.18 59.91,27.15 R35.1
N$58
  Bottom 0.305: 58.53,32.39 58.22,32.08 U$3.11
  Bottom 0.813: X4.3 59.04,38.42 59.04,32.95 58.53,32.44 58.53,32.39
N$59
  Bottom 0.305: U$3.12 58.72,31.03 59.08,31.39
  Bottom 0.813: X4.4 61.22,33.53 59.08,31.39
N$60
  Bottom 0.305: R37.2 R38.3
N$61
  Bottom 0.305: U$4.19 82.85,24.91 84.29,23.47 85.91,23.47 85.94,23.49 86.68,23.49 87.63,22.54 JP7.2
N$62
  Bottom 0.305: U$4.20 82.35,24.59 83.5,23.43 83.5,18.73 84.45,17.78 89.22,17.78 90.17,18.73 JP7.3
N$63
  Bottom 0.305: R39.1 JP7.1
N$64
  Bottom 0.305: U$4.17 84.25,28.14 84.77,27.62 84.99,27.4 84.99,24.58 R39.2
N$65
  Top 0.305: R42.2 S4.1
  Bottom 0.305: U$4.21 81.85,22.61 S4.1
N$67
  Top 0.305: R41.2 S4.2
  Bottom 0.305: U$4.22 81.35,24.51 S4.2
N$68
  Top 0.305: R40.2 S4.3
  Bottom 0.305: U$4.23 80.85,25.6 80.01,24.76 79.06,24.76 S4.3
N$69
  Bottom 0.305: U$4.13 84.18,30.14 85.78,31.74 R43.2 | U$4.14 84.06,29.64 85.96,31.55 R43.2 | R43.2 86.04,31.26 83.93,29.14 U$4.15
N$70
  Bottom 0.305: R44.2 77.63,31.63 79.12,30.14 U$4.6 | U$4.4 79.25,29.14 77.47,30.92 R44.2 | U$4.5 79.17,29.64 77.47,31.34 R44.2
N$71
  Bottom 0.305: U$4.7 80.35,31.01 79.98,31.37
  Bottom 0.813: X5.1 77.85,33.51 79.98,31.37
N$72
  Bottom 0.305: U$4.8 80.85,32.08 80.54,32.39
  Bottom 0.813: X5.2 80.03,38.42 80.03,32.94 80.54,32.43 80.54,32.39
N$73
  Bottom 0.305: U$4.24 80.35,26.37 80.01,26.03 R45.2
N$74
  Bottom 0.305: U$4.16 84.52,28.64 85.41,29.53 88.04,29.53 R47.1
N$75
  Bottom 0.305: U$4.18 84.04,27.15 R46.1
N$77
  Bottom 0.305: 82.66,32.39 82.35,32.08 U$4.11
  Bottom 0.813: X5.3 83.17,38.42 83.17,32.95 82.66,32.44 82.66,32.39
N$78
  Bottom 0.305: U$4.12 82.85,31.03 83.21,31.39
  Bottom 0.813: X5.4 85.35,33.53 83.21,31.39
N$79
  Bottom 0.305: R48.2 R49.3
N$80
  Bottom 0.305: U$5.19 106.98,24.91 108.42,23.47 110.04,23.47 110.07,23.49 110.81,23.49 111.76,22.54 JP9.2
N$81
  Bottom 0.305: U$5.20 106.48,24.59 107.63,23.43 107.63,18.73 108.59,17.78 113.35,17.78 114.3,18.73 JP9.3
N$82
  Bottom 0.305: R50.1 JP9.1
N$84
  Bottom 0.305: U$5.17 108.38,28.14 108.9,27.62 109.12,27.4 109.12,24.58 R50.2
N$85
  Top 0.305: R53.2 S5.1
  Bottom 0.305: U$5.21 105.98,22.61 S5.1
N$86
  Top 0.305: R52.2 S5.2
  Bottom 0.305: U$5.22 105.48,24.51 S5.2
N$87
  Top 0.305: R51.2 S5.3
  Bottom 0.305: U$5.23 104.98,25.6 104.14,24.76 103.19,24.76 S5.3
N$88
  Bottom 0.305: U$5.13 108.31,30.14 109.91,31.74 R54.2 | U$5.14 108.19,29.64 110.09,31.55 R54.2 | R54.2 110.17,31.26 108.06,29.14 U$5.15
N$89
  Bottom 0.305: R55.2 101.76,31.63 103.25,30.14 U$5.6 | U$5.4 103.38,29.14 101.6,30.92 R55.2 | U$5.5 103.3,29.64 101.6,31.34 R55.2
N$90
  Bottom 0.305: U$5.7 104.48,31.01 104.11,31.37
  Bottom 0.813: X6.1 101.98,33.51 104.11,31.37
N$91
  Bottom 0.305: U$5.8 104.98,32.08 104.67,32.39
  Bottom 0.813: X6.2 104.16,38.42 104.16,32.94 104.67,32.43 104.67,32.39
N$92
  Bottom 0.305: U$5.24 104.48,26.37 104.14,26.03 R56.2
N$93
  Bottom 0.305: U$5.16 108.65,28.64 109.54,29.53 112.17,29.53 R58.1
N$94
  Bottom 0.305: U$5.18 108.17,27.15 R57.1
N$96
  Bottom 0.305: 106.79,32.39 106.48,32.08 U$5.11
  Bottom 0.813: X6.3 107.29,38.42 107.29,32.95 106.79,32.44 106.79,32.39
N$97
  Bottom 0.305: U$5.12 106.98,31.03 107.34,31.39
  Bottom 0.813: X6.4 109.48,33.53 107.34,31.39
N$98
  Bottom 0.305: R59.2 R60.3
N$99
  Bottom 0.305: U$6.19 131.11,24.91 132.55,23.47 134.17,23.47 134.2,23.49 134.94,23.49 135.89,22.54 JP11.2
N$101
  Bottom 0.305: U$6.20 130.61,24.59 131.76,23.43 131.76,18.73 132.72,17.78 137.48,17.78 138.43,18.73 JP11.3
N$102
  Bottom 0.305: R61.1 JP11.1
N$103
  Bottom 0.305: U$6.17 132.51,28.14 133.03,27.62 133.25,27.4 133.25,24.58 R61.2
N$104
  Top 0.305: R64.2 S6.1
  Bottom 0.305: U$6.21 130.11,22.61 S6.1
N$105
  Top 0.305: R63.2 S6.2
  Bottom 0.305: U$6.22 129.61,24.51 S6.2
N$106
  Top 0.305: R62.2 S6.3
  Bottom 0.305: U$6.23 129.11,25.6 128.27,24.76 127.32,24.76 S6.3
N$107
  Bottom 0.305: U$6.13 132.44,30.14 134.04,31.74 R65.2 | U$6.14 132.32,29.64 134.22,31.55 R65.2 | R65.2 134.3,31.26 132.19,29.14 U$6.15
N$108
  Bottom 0.305: R66.2 125.89,31.63 127.37,30.14 U$6.6 | U$6.4 127.51,29.14 125.73,30.92 R66.2 | U$6.5 127.43,29.64 125.73,31.34 R66.2
N$109
  Bottom 0.305: U$6.7 128.61,31.01 128.24,31.37
  Bottom 0.813: X7.1 126.11,33.51 128.24,31.37
N$110
  Bottom 0.305: U$6.8 129.11,32.08 128.8,32.39
  Bottom 0.813: X7.2 128.29,38.42 128.29,32.94 128.8,32.43 128.8,32.39
N$111
  Bottom 0.305: U$6.24 128.61,26.37 128.27,26.03 R67.2
N$112
  Bottom 0.305: U$6.16 132.78,28.64 133.67,29.53 136.31,29.53 R69.1
N$113
  Bottom 0.305: U$6.18 132.3,27.15 R68.1
N$115
  Bottom 0.305: 130.92,32.39 130.61,32.08 U$6.11
  Bottom 0.813: X7.3 131.42,38.42 131.42,32.95 130.92,32.44 130.92,32.39
N$116
  Bottom 0.305: U$6.12 131.11,31.03 131.47,31.39
  Bottom 0.813: X7.4 133.61,33.53 131.47,31.39
N$117
  Bottom 0.305: R70.2 R71.3
REF1
  Bottom 0.305: U$2.1 30.82,27.64 30.16,26.99 30.16,25.4 29.53,24.76 27.08,24.76 26.67,24.35 | C5.1 26.67,24.35 | 26.67,24.35 24.67,24.35 R27.2 23.81,23.81 21.91,25.72 21.91,28.57 JP4.1
REF2
  Bottom 0.305: U$3.1 54.95,27.64 54.29,26.99 54.29,25.4 53.66,24.76 51.22,24.76 50.8,24.35 | C7.1 50.8,24.35 | 50.8,24.35 48.8,24.35 R38.2 47.94,23.81 46.04,25.72 46.04,28.57 JP6.1
REF3
  Bottom 0.305: U$4.1 79.08,27.64 78.42,26.99 78.42,25.4 77.79,24.76 75.34,24.76 74.93,24.35 | C9.1 74.93,24.35 | 74.93,24.35 72.93,24.35 R49.2 72.07,23.81 70.17,25.72 70.17,28.57 JP8.1
REF4
  Bottom 0.305: U$5.1 103.21,27.64 102.55,26.99 102.55,25.4 101.92,24.76 99.48,24.76 99.06,24.35 | C11.1 99.06,24.35 | 99.06,24.35 97.06,24.35 R60.2 96.2,23.81 94.3,25.72 94.3,28.57 JP10.1
REF5
  Bottom 0.305: U$6.1 127.34,27.64 126.68,26.99 126.68,25.4 126.05,24.76 123.61,24.76 123.19,24.35 | C13.1 123.19,24.35 | 123.19,24.35 121.19,24.35 R71.2 120.33,23.81 118.43,25.72 118.43,28.57 JP12.1